# Altium schematic sheet OPG_v8_schematics.SchDoc
size A4; SheetNumber: 1; SheetTotal: 1
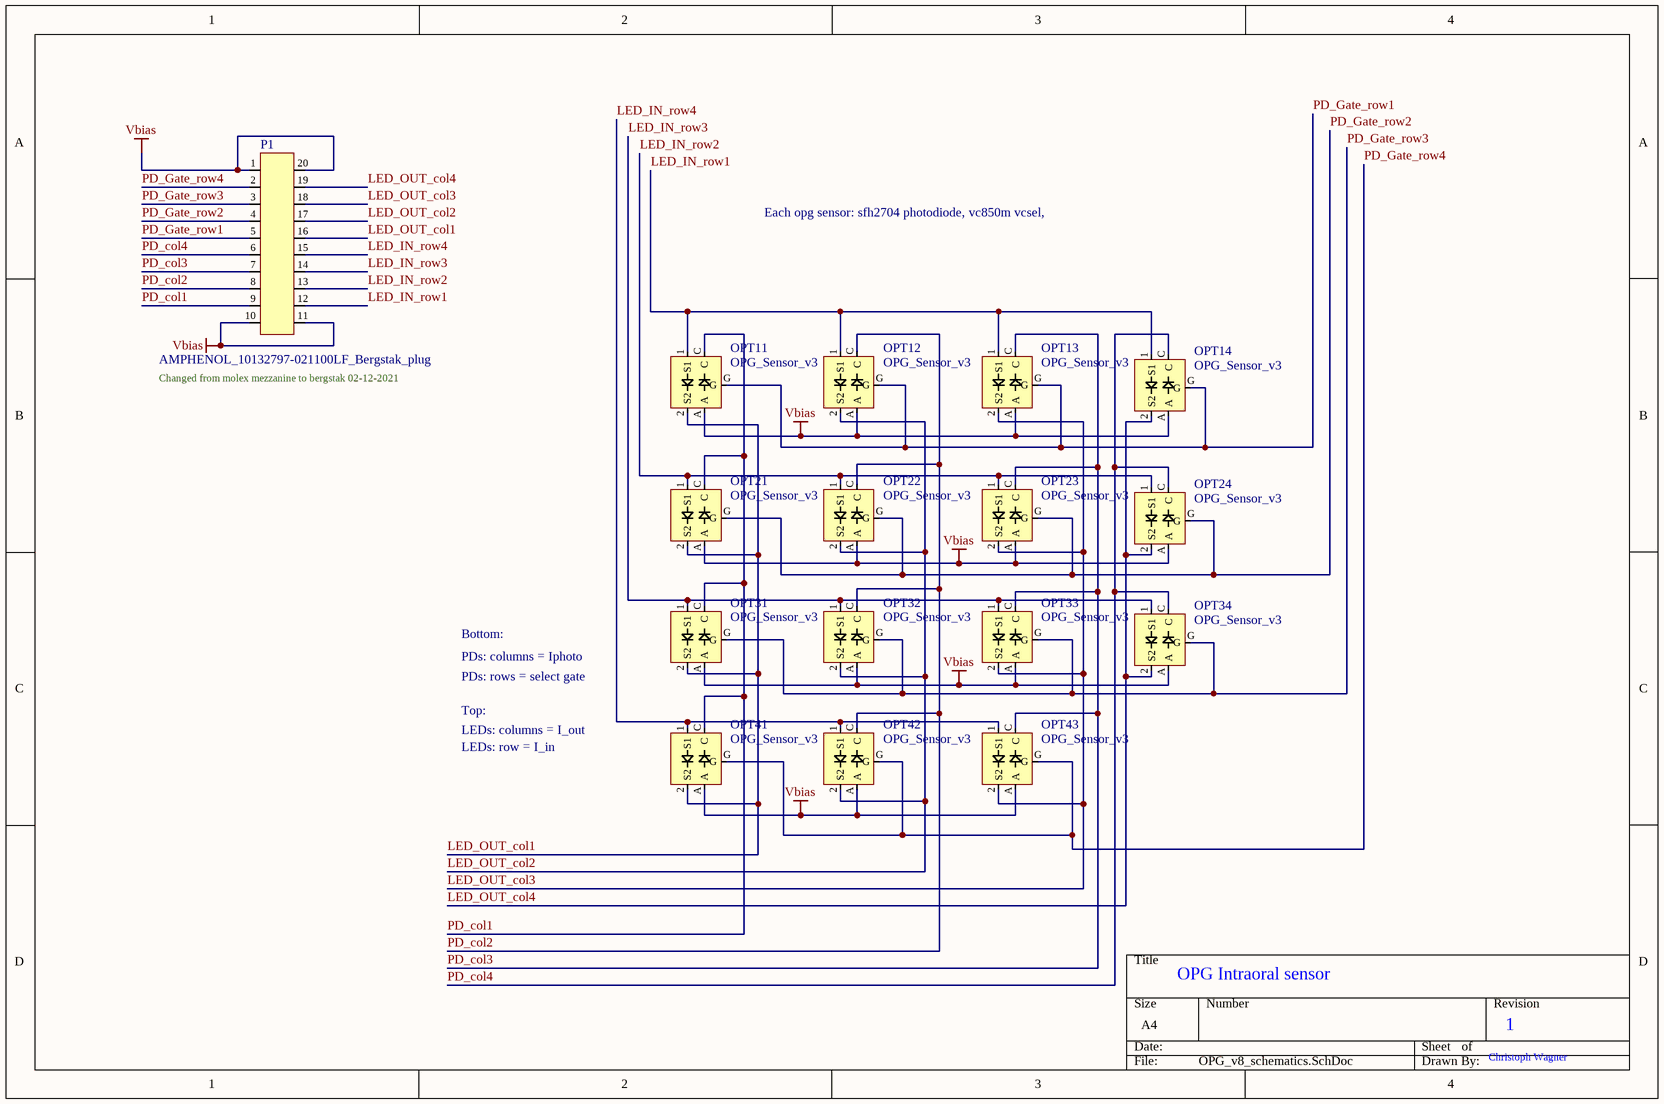
[diagram p0: OPG_v8_schematics.SchDoc]

## Parts
OPT11  OPG_Sensor_v3  [OPG_SENSOR_3]
OPT12  OPG_Sensor_v3  [OPG_SENSOR_3]
OPT13  OPG_Sensor_v3  [OPG_SENSOR_3]
OPT14  OPG_Sensor_v3  [OPG_SENSOR_3]
OPT21  OPG_Sensor_v3  [OPG_SENSOR_3]
OPT22  OPG_Sensor_v3  [OPG_SENSOR_3]
OPT23  OPG_Sensor_v3  [OPG_SENSOR_3]
OPT24  OPG_Sensor_v3  [OPG_SENSOR_3]
OPT31  OPG_Sensor_v3  [OPG_SENSOR_3]
OPT32  OPG_Sensor_v3  [OPG_SENSOR_3]
OPT33  OPG_Sensor_v3  [OPG_SENSOR_3]
OPT34  OPG_Sensor_v3  [OPG_SENSOR_3]
OPT41  OPG_Sensor_v3  [OPG_SENSOR_3]
OPT42  OPG_Sensor_v3  [OPG_SENSOR_3]
OPT43  OPG_Sensor_v3  [OPG_SENSOR_3]
P1  AMPHENOL_10132797-021100LF_Bergstak_plug  [AMPHENOL_10132797-021100LF_Bergstak_plug]

## Nets
Vbias: OPT11.A OPT12.A OPT13.A OPT14.A OPT21.A OPT22.A OPT23.A OPT24.A OPT31.A OPT32.A OPT33.A OPT34.A OPT41.A OPT42.A OPT43.A P1.1 P1.10 P1.11 P1.20
LED_IN_row1: OPT11.1(S1) OPT12.1(S1) OPT13.1(S1) OPT14.1(S1) P1.12
LED_IN_row2: OPT21.1(S1) OPT22.1(S1) OPT23.1(S1) OPT24.1(S1) P1.13
LED_IN_row3: OPT31.1(S1) OPT32.1(S1) OPT33.1(S1) OPT34.1(S1) P1.14
LED_IN_row4: OPT41.1(S1) OPT42.1(S1) OPT43.1(S1) P1.15
LED_OUT_col1: OPT11.2(S2) OPT21.2(S2) OPT31.2(S2) OPT41.2(S2) P1.16
LED_OUT_col2: OPT12.2(S2) OPT22.2(S2) OPT32.2(S2) OPT42.2(S2) P1.17
LED_OUT_col3: OPT13.2(S2) OPT23.2(S2) OPT33.2(S2) OPT43.2(S2) P1.18
LED_OUT_col4: OPT14.2(S2) OPT24.2(S2) OPT34.2(S2) P1.19
PD_col1: OPT11.C OPT21.C OPT31.C OPT41.C P1.9
PD_col2: OPT12.C OPT22.C OPT32.C OPT42.C P1.8
PD_col3: OPT13.C OPT23.C OPT33.C OPT43.C P1.7
PD_col4: OPT14.C OPT24.C OPT34.C P1.6
PD_Gate_row1: OPT11.G OPT12.G OPT13.G OPT14.G P1.5
PD_Gate_row2: OPT21.G OPT22.G OPT23.G OPT24.G P1.4
PD_Gate_row3: OPT31.G OPT32.G OPT33.G OPT34.G P1.3
PD_Gate_row4: OPT41.G OPT42.G OPT43.G P1.2

## Notes on the sheet
- Each opg sensor: sfh2704 photodiode, vc850m vcsel,
- (near P1) Changed from molex mezzanine to bergstak 02-12-2021
- PDs: columns = Iphoto
- PDs: rows = select gate
- Bottom:
- LEDs: columns = I_out
- LEDs: row = I_in
- Top:
- OPG Intraoral sensor
- 1
- Christoph Wagner

## Library data of the parts
OPT11-OPT14 OPT21-OPT24 OPT31-OPT34 OPT41-OPT43 = OPG_Sensor_v3: pin to pad: 1>S1 2>S2 C>D
P1 = AMPHENOL_10132797-021100LF_Bergstak_plug: 20 pin, 0.5 mm pitch, 3 mm mated height, plug/male